# EAGLE schematic main_board (EAGLE 7.2.0)
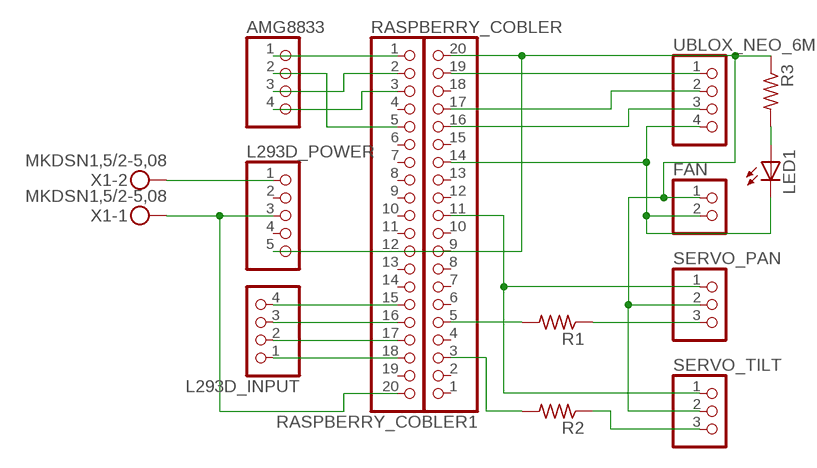
[diagram p0: schematic, sheet 1]

## Parts
AMG8833  PINHD-1X4  [1X04]
FAN  PINHD-1X2  [1X02]
L293D_INPUT  PINHD-1X4  [1X04]
L293D_POWER  PINHD-1X5  [1X05]
LED1  LED5MM  [LED5MM]
R1  R-US_0207/10  [0207/10]
R2  R-US_0207/10  [0207/10]
R3  R-US_0207/10  [0207/10]
RASPBERRY_COBLER  PINHD-1X20  [1X20]
RASPBERRY_COBLER1  PINHD-1X20  [1X20]
SERVO_PAN  PINHD-1X3  [1X03]
SERVO_TILT  PINHD-1X3  [1X03]
UBLOX_NEO_6M  PINHD-1X4  [1X04]
X1  MKDSN1,5/2-5,08  [MKDSN1,5/2-5,08]

## Nets
AMG8833: AMG8833.1 RASPBERRY_COBLER.1
GND: AMG8833.2 FAN.2 L293D_POWER.3 LED1.K(C) RASPBERRY_COBLER1.11 RASPBERRY_COBLER1.14 RASPBERRY_COBLER.5 RASPBERRY_COBLER.20 SERVO_PAN.1 SERVO_TILT.1 UBLOX_NEO_6M.4 X1.1
N$1: RASPBERRY_COBLER1.16 UBLOX_NEO_6M.3
N$4: R1.1 SERVO_PAN.3
N$6: R2.1 SERVO_TILT.3
N$8: L293D_INPUT.1 RASPBERRY_COBLER.18
N$9: L293D_INPUT.2 RASPBERRY_COBLER.17
N$10: RASPBERRY_COBLER1.17 UBLOX_NEO_6M.2
N$11: RASPBERRY_COBLER1.19 UBLOX_NEO_6M.1
N$12: L293D_INPUT.3 RASPBERRY_COBLER.16
N$13: L293D_INPUT.4 RASPBERRY_COBLER.15
N$14: R2.2 RASPBERRY_COBLER1.3
N$15: R1.2 RASPBERRY_COBLER1.5
N$16: LED1.A R3.2
N$17: L293D_POWER.1 X1.2
N$43: FAN.1 L293D_POWER.5 R3.1 RASPBERRY_COBLER1.20 SERVO_PAN.2 SERVO_TILT.2
N$44: AMG8833.3 RASPBERRY_COBLER.2
N$45: AMG8833.4 RASPBERRY_COBLER.3
Unconnected: L293D_POWER.2 L293D_POWER.4 RASPBERRY_COBLER1.1 RASPBERRY_COBLER1.2 RASPBERRY_COBLER1.4 RASPBERRY_COBLER1.6 RASPBERRY_COBLER1.7 RASPBERRY_COBLER1.8 RASPBERRY_COBLER1.9 RASPBERRY_COBLER1.10 RASPBERRY_COBLER1.12 RASPBERRY_COBLER1.13 RASPBERRY_COBLER1.15 RASPBERRY_COBLER1.18 RASPBERRY_COBLER.4 RASPBERRY_COBLER.6 RASPBERRY_COBLER.7 RASPBERRY_COBLER.8 RASPBERRY_COBLER.9 RASPBERRY_COBLER.10 RASPBERRY_COBLER.11 RASPBERRY_COBLER.12 RASPBERRY_COBLER.13 RASPBERRY_COBLER.14 RASPBERRY_COBLER.19

## Library data of the parts
AMG8833 L293D_INPUT UBLOX_NEO_6M = pinhead:PINHD-1X4: PIN HEADER
FAN = pinhead:PINHD-1X2: PIN HEADER
L293D_POWER = pinhead:PINHD-1X5: PIN HEADER
LED1 = led:LED: LED OSRAM: - CHIPLED LG R971, LG N971, LY N971, LG Q971, LY Q971, LO R971, LY R971 LH N974, LH R974 LS Q976, LO Q976, LY Q976 LO Q996 - Hyper CHIPLED LW Q18S LB Q993, LB Q99A, LB R99A - SideLED LS A670, LO A670, LY A670, LG A670, LP A670 LB A673, LV A673, LT A673, LW A673 LH A674 LY A675 LS A676, LA A676, LO A676, LY A676, LW A676 LS A679, LY A679, LG A679 - Hyper Micro SIDELED® LS Y876, LA Y876, LO Y876, LY Y876 LT Y87S - SmartLED LW L88C, LW L88S LB L89C, LB L89S, LG L890 LS L89K, LO L89K, LY L89K LS L896, LA L896, LO L896, LY L896 - TOPLED LS T670, LO T670, LY T670, LG T670, LP T670 LSG T670, LSP T670, LSY T670, LOP T670, LYG T670 LG T671, LOG T671, LSG T671 LB T673, LV T673, LT T673, LW T673 LH T674 LS T676, LA T676, LO T676, LY T676, LB T676, LH T676, LSB T676, LW T676 LB T67C, LV T67C, LT T67C, LS T67K, LO T67K, LY T67K, LW E67C LS E67B, LA E67B, LO E67B, LY E67B, LB E67C, LV E67C, LT E67C LW T67C LS T679, LY T679, LG T679 LS T770, LO T770, LY T770, LG T770, LP T770 LB T773, LV T773, LT T773, LW T773 LH T774 LS E675, LA E675, LY E675, LS T675 LS T776, LA T776, LO T776, LY T776, LB T776 LHGB T686 LT T68C, LB T68C - Hyper Mini TOPLED® LB M676 - Mini TOPLED Santana® LG M470 LS M47K, LO M47K, LY M47K Source: http://www.osram.convergy.de LUXEON: - LUMILED® LXK2-PW12-R00, LXK2-PW12-S00, LXK2-PW14-U00, LXK2-PW14-V00 LXK2-PM12-R00, LXK2-PM12-S00, LXK2-PM14-U00 LXK2-PE12-Q00, LXK2-PE12-R00, LXK2-PE12-S00, LXK2-PE14-T00, LXK2-PE14-U00 LXK2-PB12-K00, LXK2-PB12-L00, LXK2-PB12-M00, LXK2-PB14-N00, LXK2-PB14-P00, LXK2-PB14-Q00 LXK2-PR12-L00, LXK2-PR12-M00, LXK2-PR14-Q00, LXK2-PR14-R00 LXK2-PD12-Q00, LXK2-PD12-R00, LXK2-PD12-S00 LXK2-PH12-R00, LXK2-PH12-S00 LXK2-PL12-P00, LXK2-PL12-Q00, LXK2-PL12-R00 Source: www.luxeon.com KINGBRIGHT: KA-3528ASYC Source: www.kingbright.com
R1-R3 = resistor:R-US_: RESISTOR, American symbol
RASPBERRY_COBLER RASPBERRY_COBLER1 = pinhead:PINHD-1X20: PIN HEADER
SERVO_PAN SERVO_TILT = pinhead:PINHD-1X3: PIN HEADER
X1 = con-phoenix-508:MKDSN1,5/2-5,08: MKDSN 1,5/ 2-5,08 Printklemme Nennstrom: 13,5 A Nennspannung: 250 V Rastermaß: 5,08 mm Polzahl: 2 Anschlussart: Schraubanschluss Montage: Löten Anschlussrichtung Leiter/Platine: 0 ° Artikelnummer: 1729128 Source: http://eshop.phoenixcontact.com .. 1729128.pdf